# Altium project PCB_Project.PrjPcb
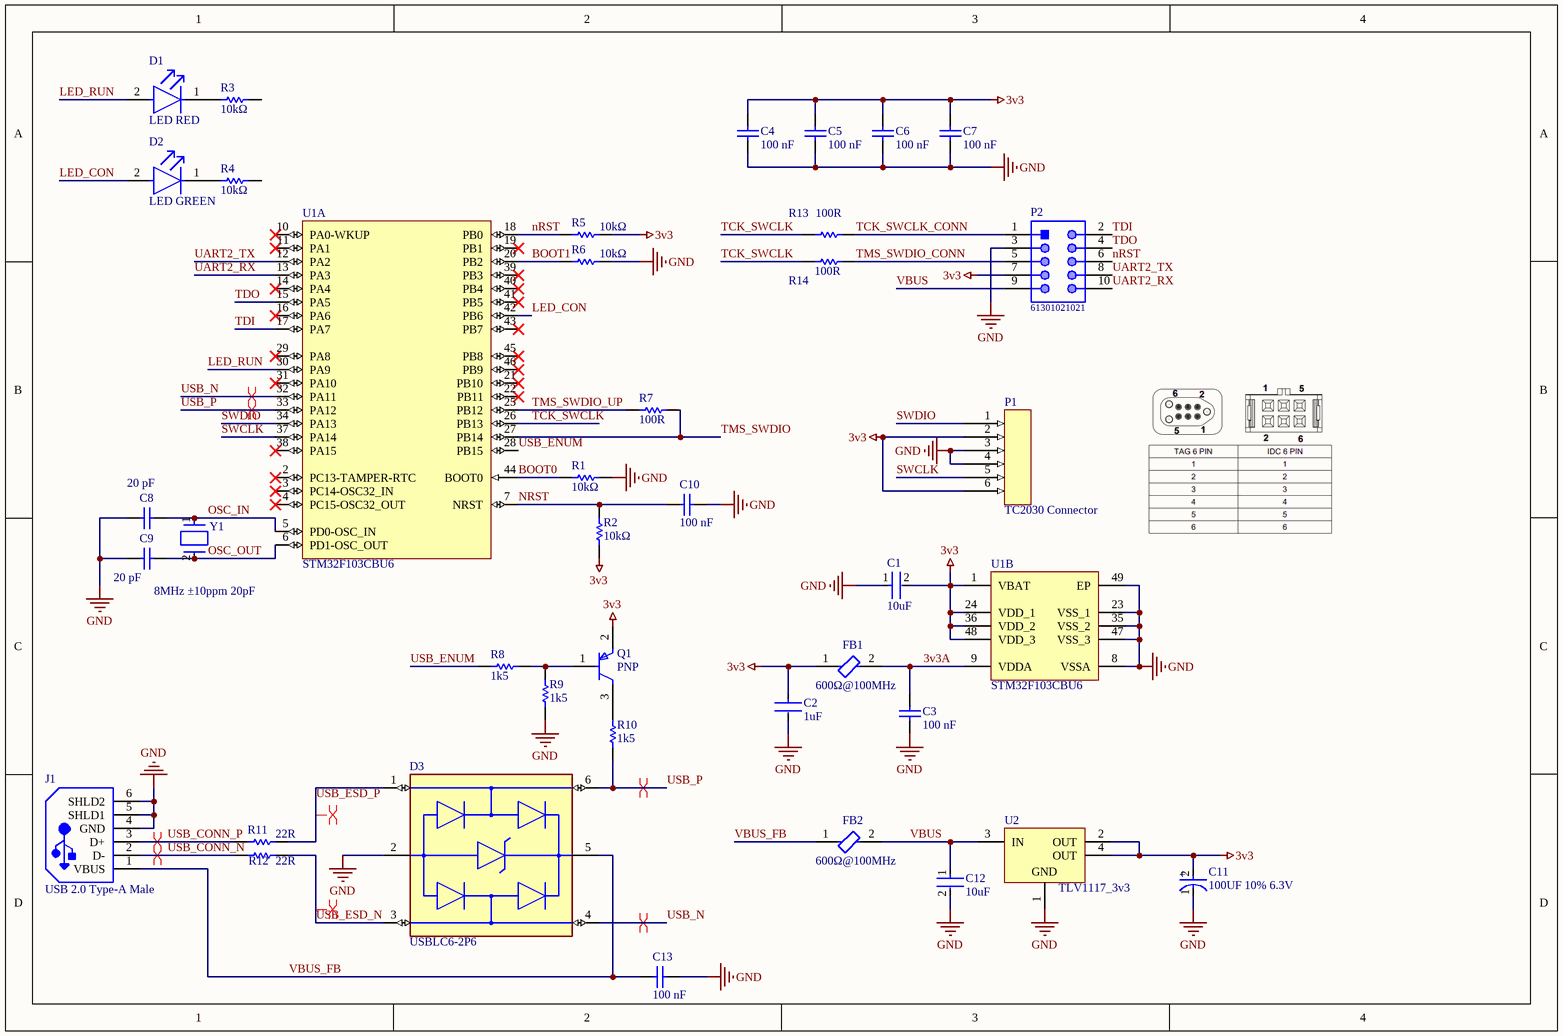
[diagram p0: Sheet1.SchDoc]
1 sheet, 39 parts. Net scope: global (net labels, ports and power ports of the same name join across sheets).
Board file: PCB1.PcbDoc

## Sheet Sheet1.SchDoc
size A4; SheetNumber: 1; SheetTotal: 1

### Parts
C1  10uF  [FP-CL10-IPC_C]
C2  1uF  [FP-CL542-IPC_C]
C3  100 nF  [CAPC1050X55X23ML05T13]
C4  100 nF  [CAPC1050X55X23ML05T13]
C5  100 nF  [CAPC1050X55X23ML05T13]
C6  100 nF  [CAPC1050X55X23ML05T13]
C7  100 nF  [CAPC1050X55X23ML05T13]
C8  20 pF  [CAPC1608X90X30LL10T20]
C9  20 pF  [CAPC1608X90X30LL10T20]
C10  100 nF  [CAPC1050X55X23ML05T13]
C11  100UF 10% 6.3V  [FP-T491B107K006AT-MFG]
C12  10uF  [FP-CL10-IPC_C]
C13  100 nF  [CAPC1050X55X23ML05T13]
D1  LED RED  [FP-150060RS75000-MFG]
D2  LED GREEN  [FP-150060RS75000-MFG]
D3  USBLC6-2P6  [FP-SOT-666-MFG]
FB1  600Ω@100MHz  [FP-BLM18-0_15-t0_8-IPC_A]
FB2  600Ω@100MHz  [FP-BLM18-0_15-t0_8-IPC_A]
J1  USB 2.0 Type-A Male  [MOLX-480-37-1000_V]
P1  TC2030 Connector  [TC2030 Connector]
P2  61301021021  [61301021021]
Q1  PNP  [FP-SOT-23-IPC_B]
R1  10kΩ  [RESC1005X40X25LL05T10]
R2  10kΩ  [RESC1005X40X25LL05T10]
R3  10kΩ  [RESC1005X40X25LL05T10]
R4  10kΩ  [RESC1005X40X25LL05T10]
R5  10kΩ  [RESC1005X40X25LL05T10]
R6  10kΩ  [RESC1005X40X25LL05T10]
R7  100R  [RESC1005X40X25NL05T10]
R8  1k5  [RESC1005X40X25NL05T10]
R9  1k5  [RESC1005X40X25NL05T10]
R10  1k5  [RESC1005X40X25NL05T10]
R11  22R  [RESC1005X40X25ML05T05]
R12  22R  [RESC1005X40X25ML05T05]
R13  100R  [RESC1005X40X25NL05T10]
R14  100R  [RESC1005X40X25NL05T10]
U1  STM32F103CBU6  [STM-UFQFPN48_N]  (parts A,B of 2)
U2  TLV1117_3v3  [DCY0004A_N]
Y1  8MHz ±10ppm 20pF  [FP-ABM3-MFG]

### Nets
3v3: C1.2 C2.1 C4.2 C5.2 C6.2 C7.2 C11.2(A) FB1.1 P1.2 P1.6 P2.7 Q1.2(E) R2.2 R5.2 U1.1(VBAT) U1.24(VDD_1) U1.36(VDD_2) U1.48(VDD_3) U2.2(OUT) U2.4(OUT)
GND: C1.1 C2.2 C3.1 C4.1 C5.1 C6.1 C7.1 C8.1 C9.1 C10.1 C11.1(C) C12.2 C13.2 D3.2(GND) J1.4(GND) J1.5(SHLD1) J1.6(SHLD2) P1.3 P1.4 P2.3 R1.2 R6.2 R9.1 U1.8(VSSA) U1.23(VSS_1) U1.35(VSS_2) U1.47(VSS_3) U1.49(EP) U2.1(GND)
3v3A: C3.2 FB1.2 U1.9(VDDA)
BOOT0: R1.1 U1.44(BOOT0)
BOOT1: R6.1 U1.20(PB2)
LED_CON: D2.2(A) U1.42(PB6)
LED_RUN: D1.2(A) U1.30(PA9)
NRST: C10.2 P2.6 R2.1 R5.1 U1.7(NRST) U1.18(PB0)
OSC_IN: C8.2 U1.5(PD0-OSC_IN) Y1.1
OSC_OUT: C9.2 U1.6(PD1-OSC_OUT) Y1.2
SWCLK: P1.5 U1.37(PA14)
SWDIO: P1.1 U1.34(PA13)
TCK_SWCLK: R13.2 R14.2 U1.26(PB13)
TCK_SWCLK_CONN: P2.1 R13.1
TDI: P2.2 U1.17(PA7)
TDO: P2.4 U1.15(PA5)
TMS_SWDIO: R7.1 U1.27(PB14)
TMS_SWDIO_CONN: P2.5 R14.1
TMS_SWDIO_UP: R7.2 U1.25(PB12)
UART2_RX: P2.10 U1.13(PA3)
UART2_TX: P2.8 U1.12(PA2)
USB_CONN_N: J1.2(D-) R12.1
USB_CONN_P: J1.3(D+) R11.1
USB_ENUM: R8.1 U1.28(PB15)
USB_ESD_N: D3.3(I/O2) R12.2
USB_ESD_P: D3.1(I/O1) R11.2
USB_N: D3.4(I/O2) U1.32(PA11)
USB_P: D3.6(I/O1) R10.1 U1.33(PA12)
VBUS: C12.1 FB2.2 P2.9 U2.3(IN)
VBUS_FB: C13.1 D3.5(VBUS) FB2.1 J1.1(VBUS)
NetD1_1: D1.1(C) R3.1
NetD2_1: D2.1(C) R4.1
NetQ1_1: Q1.1(B) R8.2 R9.2
NetQ1_3: Q1.3(C) R10.2

Not connected (* = marked no-connect by the designer): R3 2; R4 2; U1 2(PC13-TAMPER-RTC)* 3(PC14-OSC32_IN)* 4(PC15-OSC32_OUT)* 10(PA0-WKUP)* 11(PA1)* 14(PA4)* 16(PA6)* 19(PB1)* 21(PB10)* 22(PB11)* 29(PA8)* 31(PA10)* 38(PA15)* 39(PB3)* 40(PB4)* 41(PB5)* 43(PB7)* 45(PB8)* 46(PB9)*

### Layout directives
differential pair: USB_CONN_N, USB_CONN_P, USB_ESD_N, USB_ESD_P, USB_N, USB_P

### Notes on the sheet
- (in symbol CMP-03017-000031-1) +

### Library data of the parts
C1 C12 = CMP-13271-004224-1: CL10A106MA8NRNC, Cap Ceramic 10uF 25V X5R ±20% Pad SMD 0603 +85°C T/R; Width: 0.031inch; Voltage Rating: 25V; Length: 0.063inch; Case Code (Metric): 1608; Dielectric: X5R; Termination: Wraparound; Capacitance: 10uF; Lead Free: Lead Free; Mount: Surface Mount; Package Quantity: 1; Case Code (Imperial): 0603; Thickness: 0.035inch; Packaging: Tape and Reel; Contact Plating: Tin; Min Operating Temperature: -55°C; Tolerance: 20%; Max Operating Temperature: 85°C; Case/Package: 0603
C2 = CMP-13271-001051-1: CL05A105KA5NQNC, Cap Ceramic 1uF 25V X5R ±10% SMD 0402 +85°C Paper T/R; Radiation Hardening: No; Lead Free: Lead Free; Capacitance: 1uF; Package Quantity: 10000; Max Operating Temperature: 85°C; Voltage Rating: 25V; Case/Package: 0402; Min Operating Temperature: -55°C; Packaging: Tape and Reel; Tolerance: 10%; Height: 0.5mm; Thickness: 0.022inch; Case Code (Metric): 1005; Width: 0.02inch; Case Code (Imperial): 0402; Dielectric: X5R; Length: 1mm; Mount: Surface Mount; Material: Ceramic; Depth: 0.5mm
C3-C7 C10 C13 = CMP-2000-05439-1: CL05B104KO5NNNC, 100 nF, +/- 10%, 16 V, -55 to 125 degC, 0402 (1005 Metric); Manufacturer: Samsung Electro-Mechanics; Capacitance: 100000pF; Dielectric: X7R; Rated Voltage: 16V; Case Size/Dimension: 0402; Tolerance (%): ±10%; Manufacturer URL: http://www.samsungsem.com/global/index.jsp; Datasheet URL: https://datasheet.ciiva.com/29198/458718-da-01-en-vs-kondensator-0402-29198423.pdf; Datasheet Version: Nov-10
C8 C9 = CMP-2000-06100-1: CL10C200JB8NNNC, Chip Capacitor, 20 pF, +/- 5%, 50 V, -55 to 85 degC, 0603 (1608 Metric), RoHS, Tape and Reel; Manufacturer: Samsung Electro-Mechanics; Dielectric: C0G; Rated Voltage: 50V; Capacitance: 20pF; Tolerance (%): ±5%; Case Size/Dimension: 0603; Datasheet Version: 06/2016; Manufacturer URL: http://www.samsungsem.com/global/index.jsp; Datasheet URL: http://www.samsungsem.com/kr/support/product-search/mlcc/__icsFiles/afieldfile/2016/08/18/S_CL10C200JB8NNNC.pdf; Mounting Technology: SurfaceMount; Package Description: 2-Pin Surface Mount Device, Body 1.60 x 0.80 mm; Package Reference: 0603
C11 = CMP-03017-000031-1: T491B107K006AT, CAP TANT 100UF 10% 6.3V 1411; Voltage Rating (DC): 6V; ESR (Equivalent Series Resistance): 3R; Dielectric Material: Tantalum; Leakage Current: 6.3uA; Dissipation Factor: 15%; Polarity: Polar; Life (Hours): 2000Hour; Case Code (Imperial): 1411; Voltage: 6.3V; Radiation Hardening: No; Failure Rate: 0.001%; Max Operating Temperature: 125°C; Min Operating Temperature: -55°C; Voltage Rating: 6.3V; Length: 3.5mm; Depth: 2.8mm; Package Quantity: 1; Case/Package: 1411; Height - Seated (Max): 0.083inch; Termination: SMD/SMT; REACH SVHC: No SVHC; Width: 2.8mm; Mount: Surface Mount; Number of Pins: 2; Case Code (Metric): 3528; Tolerance: 10%; Lead Free: Lead Free; Capacitance: 100uF; Features: General Purpose; Height: 1.9mm; Packaging: Tape and Reel; RoHS Compliant: Yes
D1 = CMP-1426-00001-2: LED RED 0603 SMD; Luminous Intensity: 250mcd; Viewing Angle: 140°; Dominant Wavelength: 625nm; Test Current: 20mA; Lens Transparency: Clear; Forward Current: 30mA; Forward Voltage: 2V; Lens Color: Colorless; Lens Size: 0.7mm; Width: 0.8mm; Series: WL-SMCW; Color: Red; Min Operating Temperature: -40°C; RoHS Compliant: Yes; Height: 0.8mm; Package Quantity: 1; Packaging: Cut Tape; Mount: Surface Mount; Case/Package: 0603; Length: 1.6mm; Case Code (Imperial): 0603; Lens Style: Clear; Wavelength: 625nm; Max Operating Temperature: 85°C; Case Code (Metric): 1608
D2 = CMP-1426-00001-2: LED GREEN 0603 SMD; Luminous Intensity: 250mcd; Color: Red; Viewing Angle: 140°; Dominant Wavelength: 625nm; Test Current: 20mA; Lens Transparency: Clear; Forward Current: 30mA; Forward Voltage: 2V; Lens Color: Colorless; Lens Size: 0.7mm; Width: 0.8mm; Series: WL-SMCW; Min Operating Temperature: -40°C; RoHS Compliant: Yes; Height: 0.8mm; Package Quantity: 1; Packaging: Cut Tape; Mount: Surface Mount; Case/Package: 0603; Length: 1.6mm; Case Code (Imperial): 0603; Lens Style: Clear; Wavelength: 625nm; Max Operating Temperature: 85°C; Case Code (Metric): 1608
D3 = CMP-12225-000058-1: TVS DIODE 5.25V 17V SOT666; Min Breakdown Voltage: 6V; Power Line Protection: Yes; Element Configuration: Dual; Test Current: 1mA; Working Voltage: 5V; Number of Channels: 2; Max Reverse Leakage Current: 150nA; Direction: Unidirectional; Peak Pulse Current: 5A; Number of Elements: 1; Capacitance: 3.5pF; Max Breakdown Voltage: 6V; Height: 0.6mm; Depth: 1.3mm; Contact Plating: Tin; Reverse Breakdown Voltage: 6V; REACH SVHC: No SVHC; Operating Supply Voltage: 5V; Width: 1.3mm; Max Operating Temperature: 125°C; Reverse Standoff Voltage: 5V; ESD Protection: Yes; Package Quantity: 1; Termination: SMD/SMT; Length: 1.7mm; Leakage Current: 150nA; Number of Bidirectional Channels: 2; Case/Package: SOT-666; Min Operating Temperature: -40°C; Number of Pins: 6; Clamping Voltage: 17V; Breakdown Voltage: 6V; Lead Free: Lead Free; Radiation Hardening: No; Packaging: Tape and Reel; Mount: Surface Mount; Polarity: Unidirectional
FB1 FB2 = CMP-0686-00581-3: BLM18KG601SN1D, Chip Ferrite Bead, 0603, 600Ω @ 100MHz, 0.15Ω, 25%; Material: Steel; DC Current: 1.3A; Number of Lines: 1; Impedance: 600R; DC Resistance (DCR): 150mR; Tolerance: 25%; Case Code (Metric): 1608; Width: 0.8mm; Max DC Current: 1.3A; Package Quantity: 1; Number of Pins: 2; Military Standard: Not; RoHS Compliant: Yes; Termination: SMD/SMT; Max Operating Temperature: 125°C; Length: 1.6mm; Depth: 0.8mm; Case Code (Imperial): 0603; Series: BLM18K; Inductor Type: FERRITE BEAD; Core Material: Ferrite; Number of Circuits: 1; Height: 0.8mm; Case/Package: 0603; REACH SVHC: No SVHC; Packaging: Tape and Reel; Min Operating Temperature: -55°C; Max Current Rating: 1.3A; Radiation Hardening: No; Current Rating: 1.3A; Lead Free: Lead Free; Test Frequency: 100MHz; Weight: 7.1E-05oz
J1 = CMP-1676-00005-1: Universal Serial Bus (USB) Shielded I/O Plug, Type A, Right Angle Connector, 1.5 A, -20 to 85 degC, 4-Pin SMD, RoHS, Tray; Tolerance: 1%; Power Rating: 100 mW; Voltage Rating: 50 V; Case\Package: 0603; Resistance: 1 mohm; Width: 0.8 mm; Mount: Surface Mount; ComponentLink1URL: http://www.molex.com/; ComponentLink1Description: Manufacturer URL; REACH SVHC: No SVHC; Case Code (Imperial): 0603; Height: 0.45 mm; Max Operating Temperature: 155 degC; ComponentLink2Description: Datasheet; Min Operating Temperature: -55 degC; Length: 1.6 mm; Pins: 2; RoHSCompliant: true; Package Quantity: 5000; DatasheetVersion: Rev. D, 06/2004; PackageDescription: 4-Pin Surface Mount Device, Body 12 x 18.8 mm; Voltage Rating (DC): 50 V; PackageReference: 480-37-1000; Case Code (Metric): 1608; ComponentLink2URL: http://www.molex.com/pdm_docs/sd/480371000_sd.pdf; Packaging: Tape and Reel
P2 = CMP-1502-01083-1: THT Angled Pin Header WR-PHD, Pitch 2.54 mm, Dual Row, 10 pins; Manufacturer: Wurth Elektronik; Pin Number: 10; Working Voltage: 250VAC; Contact Resistance: 20mOhm; Rated Current: 3A; Withstanding Voltage: 500VAC; Gender: Male; Pitch: 2.54mm; Orientation: Angled; Part Number: 61301021021; Publisher: WurthElektronik; Manufacturer URL: http://www.we-online.de; Packaging: Bag; Row Number: Dual; Package Reference: 61301021021; Operating Temperature: -40to105degC; Mounting Technology: THT; Datasheet URL: https://katalog.we-online.de/em/datasheet/6130xx21021.pdf
Q1 = CMP-56214-000002-1: MMSS8550-H-TP,TRANS PNP 25V 1.5A SOT23; Emitter Base Voltage (VEBO): 1.6V; Collector Base Voltage (VCBO): 40V; Collector Emitter Saturation Voltage: 500mV; Max Power Dissipation: 625mW; Transition Frequency: 100MHz; Element Configuration: Single; hFE Min: 40; Polarity: PNP; Lead Free: Lead Free; Max Breakdown Voltage: 25V; Package Quantity: 1; Min Operating Temperature: -55°C; Case/Package: SOT-23; Max Collector Current: 1.5A; Mount: Surface Mount; Packaging: Tape and Reel; Collector Emitter Voltage (VCEO): 500mV; Max Operating Temperature: 150°C; Gain Bandwidth Product: 100MHz; Collector Emitter Breakdown Voltage: 25V
R1-R6 = CMP-2002-07353-1: ±1% 62.5mW; Part Number: RC0402FR-0710KL; Manufacturer: Yageo / Phycomp
R7 R13 R14 = CMP-2002-07344-1: Part Number: RC0402FR-07100RL; Manufacturer: Yageo / Phycomp
R8-R10 = CMP-2002-07464-1: RC0402FR-071K5L; Manufacturer: Yageo / Phycomp; Part Number: RC0402FR-071K5L
R11 R12 = CMP-2002-01135-4: ERJ-2RKF22R0X, Chip Resistor, 22 Ohm, +/- 1%, 0.1 W, -55 to 155 degC, 0402 (1005 Metric), RoHS, Tape and Reel; Case\/Package: 0402; Resistance: 22 Ohm; Power Rating: 100 mW; Voltage Rating: 50 V; ComponentLink2Description: Datasheet; PartNumber: ERJ-2RKF22R0X; Packaging: Tape and Reel; Weight: 2.8E-05oz; Pins: 2; Case Code (Imperial): 0402; Width: 0.5 mm; ComponentLink2URL: http://industrial.panasonic.com/cdbs/www-data/pdf/RDA0000/AOA0000C86.pdf; Height: 0.35 mm; PackageReference: 0402; REACH SVHC: Yes; Min Operating Temperature: -55 degC; Length: 1 mm; DatasheetVersion: 04/2015; RoHSCompliant: true; Package Quantity: 10000; Case Code (Metric): 1005; PackageDescription: 2-Pin Surface Mount Device, Body 1 x 0.5 mm; ComponentLink1URL: http://www.panasonic.com/; Mount: Surface Mount; Mounting Technology: Surface Mount; Tolerance: 1%; Max Operating Temperature: 155 degC; ComponentLink1Description: Manufacturer URL
U1 = CMP-0237-00051-3: ARM Cortex-M3 32-bit MCU, 128 KB Flash, 20 KB Internal RAM, 37 I/Os, 48-pin UFQFPN, -40 to 85 degC, Tray; I/Os (High Current): 37; Supply Voltage(Vcc) min (V): 2; FLASH Size (Prog) (kB): 128; Operating Frequency(F) (Processor speed) (MHz): 72; A/D Converter: 2x12-bit (10 Channel); Internal RAM Size (kB): 20; DatasheetVersion: Rev. 16; ComponentLink2Description: Datasheet; ComponentLink3Description: Package Specification; ComponentLink1URL: http://www.st.com/web/en/home.html; PackageVersion: Rev. 1, 04/2013; ComponentLink2URL: http://www.st.com/st-web-ui/static/active/en/resource/technical/document/datasheet/CD00161566.pdf; PackageDescription: 48-Pin Ultra Thin Fine Pitch Quad Flat No-Lead, 7 x 7 x 0.6 mm Body, 0.5 mm Pitch, Exposed Pad; Mounting Technology: Surface Mount; Packing: Tray; Core: ARM Cortex-M3; ComponentLink3URL: http://www.st.com/st-web-ui/static/active/en/resource/technical/document/data_brief/DM00071938.pdf; PackageReference: UFQFPN48; ComponentLink1Description: Manufacturer URL; PartNumber: STM32F103CBU6
U2 = CMP-0395-00503-2: Single Output LDO, 1 A, Fixed 3.3 V Output, 2 to 5.5 V Input, 4-pin SOT-223 (DCY), -40 to 125 degC, Green (RoHS & no Sb/Br); Manufacturer: Texas Instruments; PartNumber: TLV1117LV33DCYR; Vout Adj(Min)(V): 3.3; Vdo(Typ)(mV): 1200; Iq(Typ)(mA): 0.05; Accuracy(%): 2; Iout(Max)(A): 1; SubFamily: Single Channel LDO; Vin(Max)(V): 5.5; PackageReference: DCY0004A; PackageDescription: 4-Pin Plastic Small Outline, Body 3.5 x 6.5 mm, Pitch 2.3 mm; Vout Adj(Max)(V): 3.3; Mounting Technology: Surface Mount; ComponentLink2Description: Datasheet; ComponentLink1Description: Manufacturer URL; ComponentLink3Description: Package Specification; ComponentLink1URL: http://www.ti.com/; ComponentLink2URL: http://www.ti.com/general/docs/lit/getliterature.tsp?genericPartNumber=TLV1117LV33&fileType=pdf; Fixed Output Options(V): 3.3; PackageVersion: 4202506/B; Vin(Min)(V): 2; DatasheetVersion: SBVS160A; Eco-Plan: Green (RoHS & no Sb/Br); ComponentLink3URL: http://www.ti.com/litv/pdf/mpds094a; Code_JEDEC: TO-261
Y1 = CMP-2000-05033-2: Load Capacitance: 18pF; Tolerance: 20ppm; Series Resistance: 500R; Frequency Stability: 30ppm; ESR (Equivalent Series Resistance): 140R; Height: 0.051inch; Depth: 3.2mm; Max Operating Temperature: 85°C; Frequency: 8MHz; Termination: SMD/SMT; Lead Free: Lead Free; Number of Pins: 2; Width: 3.2mm; RoHS Compliant: Yes; Resistor Type: Ceramic; Length: 5mm; Mount: Surface Mount; Case/Package: CSMD; Package Quantity: 1000; Radiation Hardening: No; Min Operating Temperature: -40°C; Packaging: Tape and Reel; Frequency Tolerance: 20ppm